# Altium schematic sheet Image.SchDoc
size C; SheetNumber: 1; SheetTotal: 1
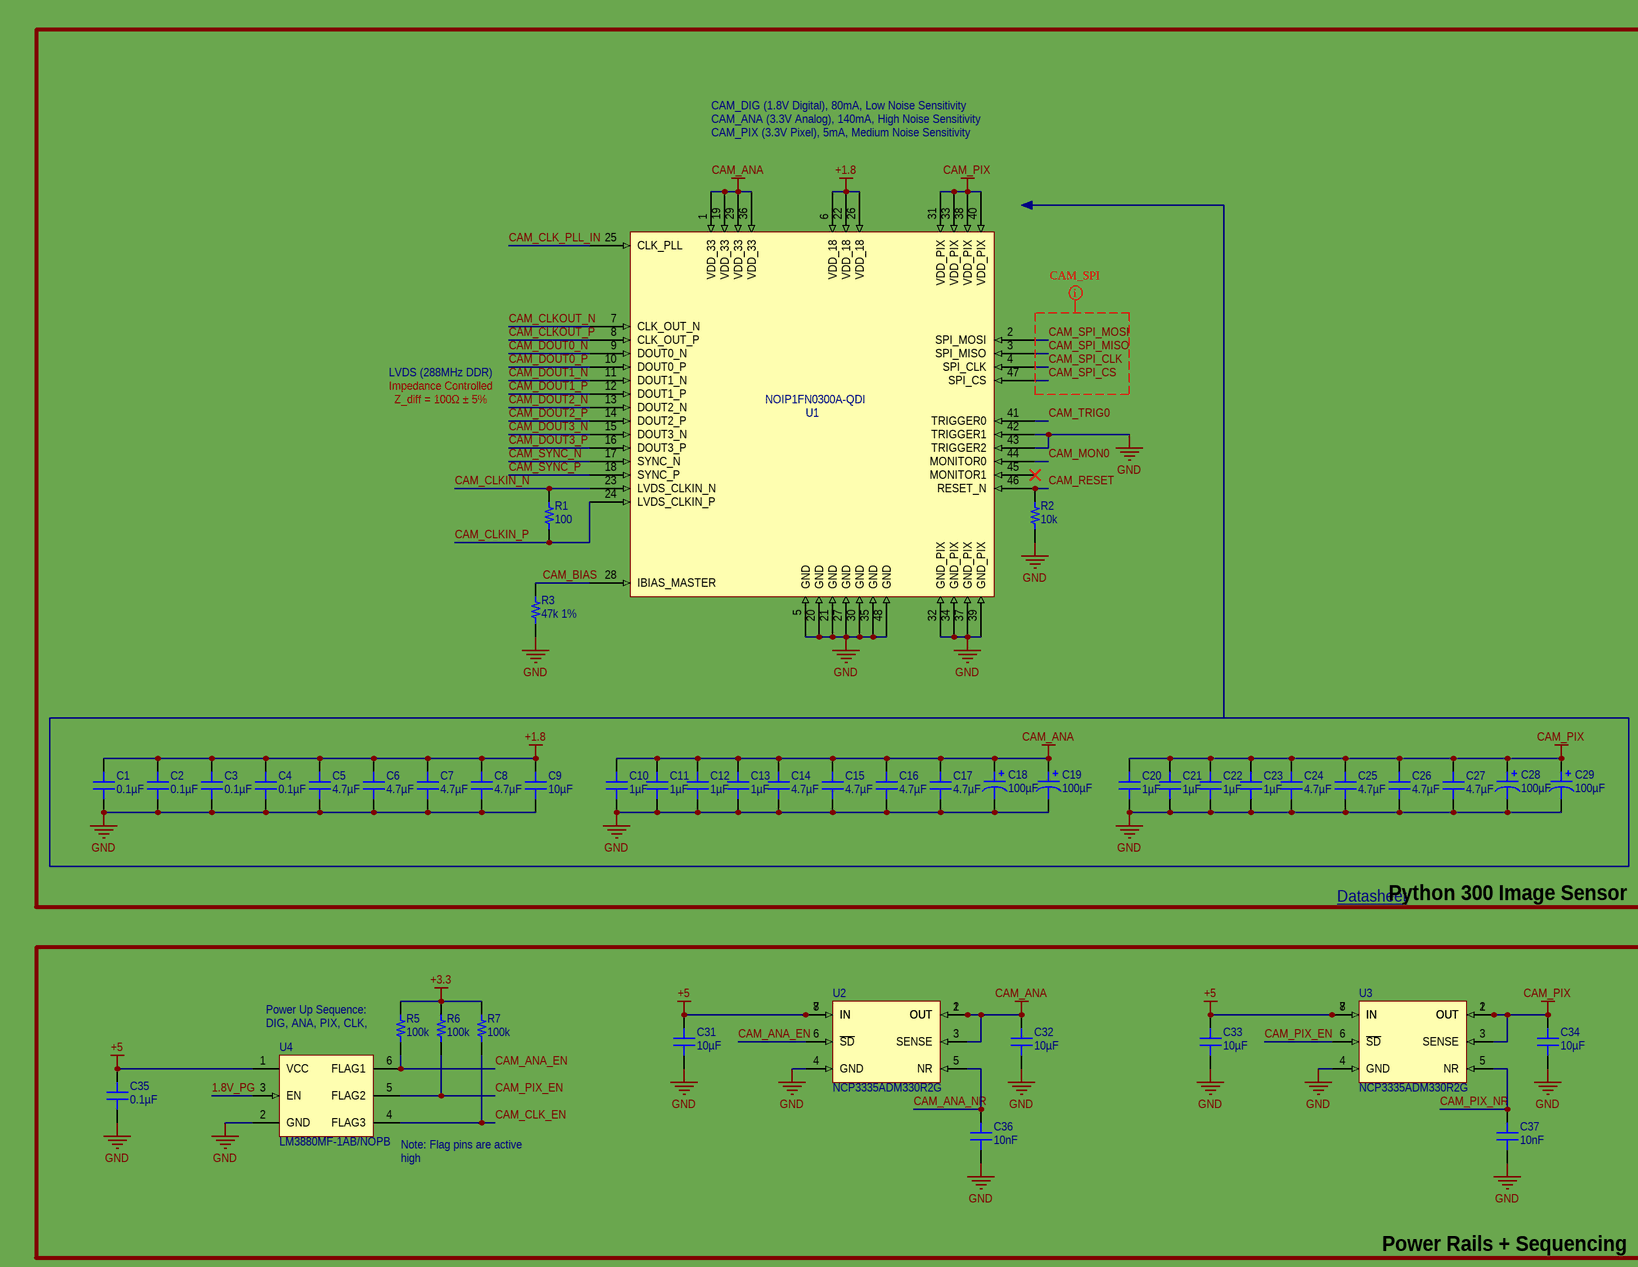
[diagram p0: Image.SchDoc, left]
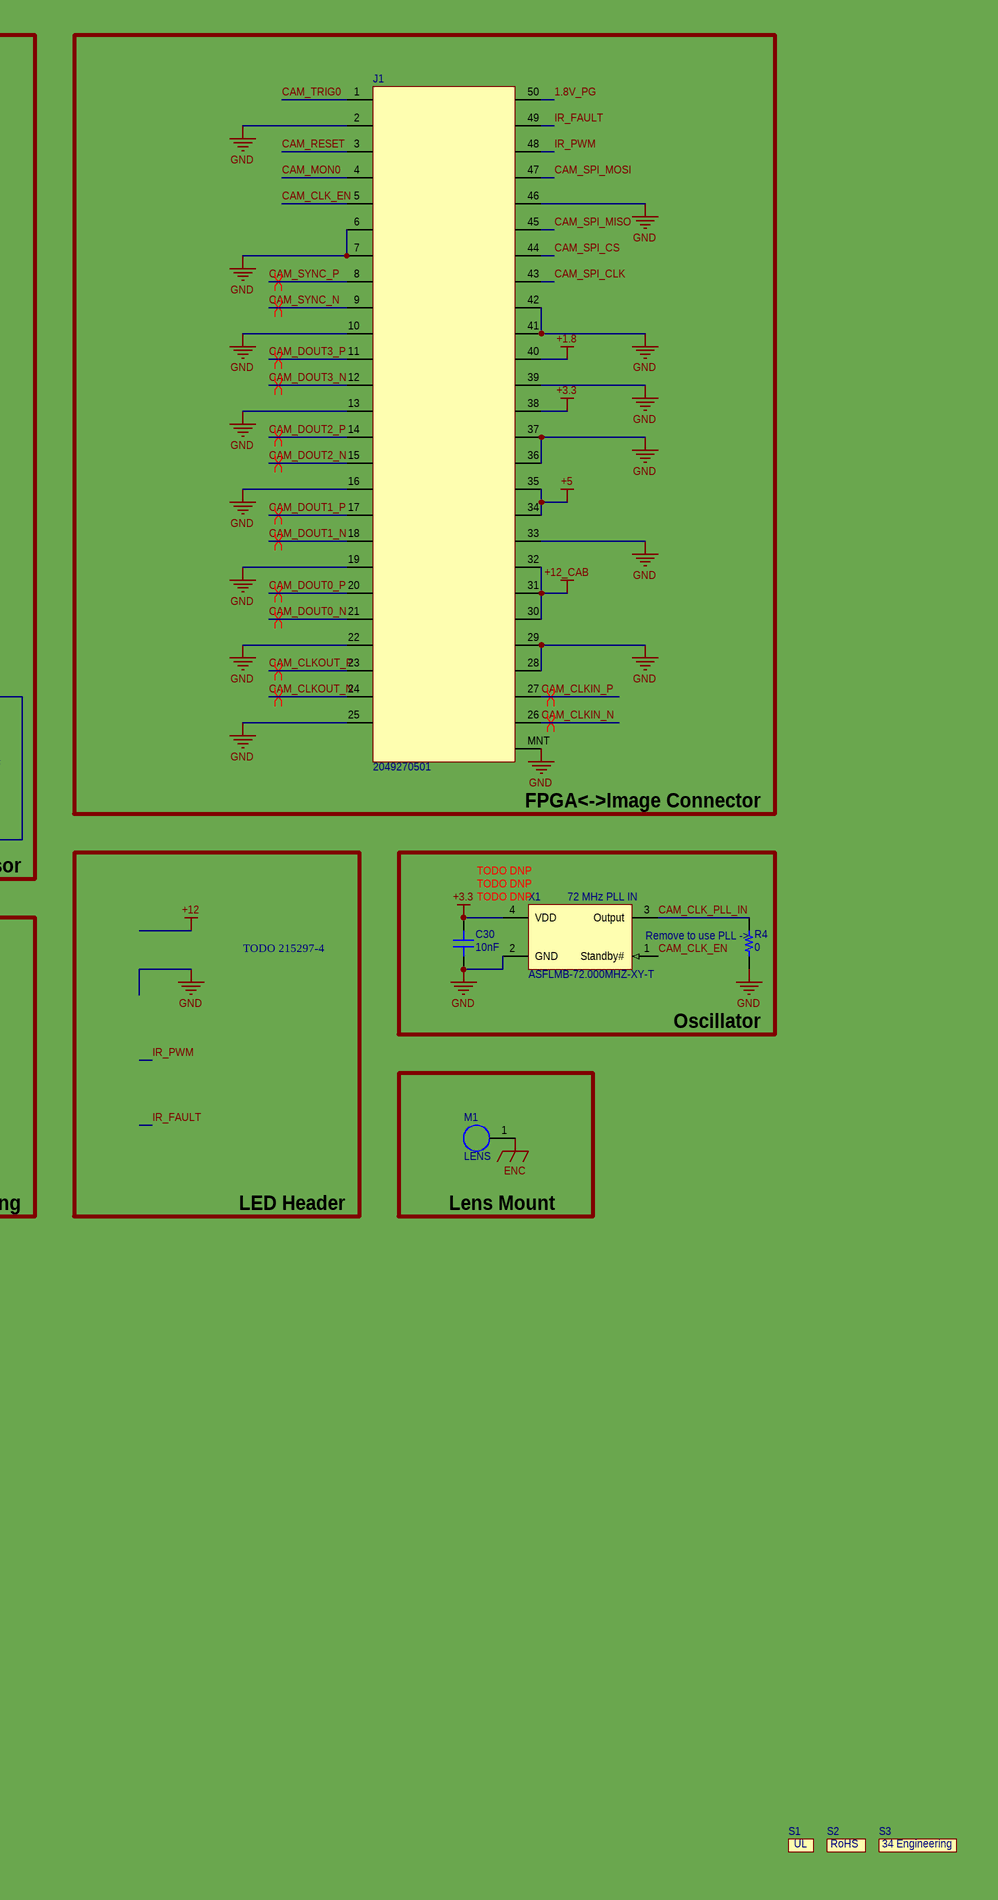
[diagram p1: Image.SchDoc, right]

## Parts
C1  0.1µF  [CAP 0402_1005]
C2  0.1µF  [CAP 0402_1005]
C3  0.1µF  [CAP 0402_1005]
C4  0.1µF  [CAP 0402_1005]
C5  4.7µF  [CAP 0402_1005]
C6  4.7µF  [CAP 0402_1005]
C7  4.7µF  [CAP 0402_1005]
C8  4.7µF  [CAP 0402_1005]
C9  10µF  [CAP 0603_1608]
C10  1µF  [CAP 0402_1005]
C11  1µF  [CAP 0402_1005]
C12  1µF  [CAP 0402_1005]
C13  1µF  [CAP 0402_1005]
C14  4.7µF  [CAP 0402_1005]
C15  4.7µF  [CAP 0402_1005]
C16  4.7µF  [CAP 0402_1005]
C17  4.7µF  [CAP 0402_1005]
C18  100µF  [CAP POL 1411_3528]
C19  100µF  [CAP POL 1411_3528]
C20  1µF  [CAP 0402_1005]
C21  1µF  [CAP 0402_1005]
C22  1µF  [CAP 0402_1005]
C23  1µF  [CAP 0402_1005]
C24  4.7µF  [CAP 0402_1005]
C25  4.7µF  [CAP 0402_1005]
C26  4.7µF  [CAP 0402_1005]
C27  4.7µF  [CAP 0402_1005]
C28  100µF  [CAP POL 1411_3528]
C29  100µF  [CAP POL 1411_3528]
C30  10nF  [CAP 0402_1005]
C31  10µF  [CAP 0402_1005]
C32  10µF  [CAP 0402_1005]
C33  10µF  [CAP 0402_1005]
C34  10µF  [CAP 0402_1005]
C35  0.1µF  [CAP 0402_1005]
C36  10nF  [CAP 0402_1005]
C37  10nF  [CAP 0402_1005]
J1  2049270501  [2049270501]
M1  LENS  [LENS_MNT]
R1  100  [RES 0402_1005]
R2  10k  [RES 0402_1005]
R3  47k 1%  [RES 0402_1005]
R4  0  [RES 0603_1608]
R5  100k  [RES 0402_1005]
R6  100k  [RES 0402_1005]
R7  100k  [RES 0402_1005]
S1  (no value)  [UL]
S2  (no value)  [RoHS]
S3  (no value)  [34EngineeringLogo]
U1  NOIP1FN0300A-QDI  [NOIP1FN0300A-QDI]
U2  NCP3335ADM330R2G  [NCP3335ADM330R2G]
U3  NCP3335ADM330R2G  [NCP3335ADM330R2G]
U4  LM3880MF-1AB/NOPB  [DBV0006A_M]
X1  ASFLMB-72.000MHZ-XY-T  [ASFLMB-72.000MHZ-XY-T]

## Blocks framed on the sheet
Python 300 Image Sensor: C1-C29 R1-R3 U1
FPGA<->Image Connector: J1
Oscillator: C30 R4 X1
Power Rails + Sequencing: C31-C37 R5-R7 U2-U4
Lens Mount: M1

## Nets
+1.8: C1.2 C2.2 C3.2 C4.2 C5.2 C6.2 C7.2 C8.2 C9.2 J1.40 U1.6(VDD_18) U1.22(VDD_18) U1.26(VDD_18)
+3.3: C30.2 J1.38 R5.2 R6.2 R7.2 X1.4(VDD)
+5: C31.2 C33.2 C35.2 J1.34 J1.35 U2.7(IN) U2.8(IN) U3.7(IN) U3.8(IN) U4.1(VCC)
+12_CAB: J1.30 J1.31 J1.32
CAM_ANA: C10.2 C11.2 C12.2 C13.2 C14.2 C15.2 C16.2 C17.2 C18.1 C19.1 C32.2 U1.1(VDD_33) U1.19(VDD_33) U1.29(VDD_33) U1.36(VDD_33) U2.1(OUT) U2.2(OUT) U2.3(SENSE)
CAM_PIX: C20.2 C21.2 C22.2 C23.2 C24.2 C25.2 C26.2 C27.2 C28.1 C29.1 C34.2 U1.31(VDD_PIX) U1.33(VDD_PIX) U1.38(VDD_PIX) U1.40(VDD_PIX) U3.1(OUT) U3.2(OUT) U3.3(SENSE)
ENC: M1.1
GND: C1.1 C2.1 C3.1 C4.1 C5.1 C6.1 C7.1 C8.1 C9.1 C10.1 C11.1 C12.1 C13.1 C14.1 C15.1 C16.1 C17.1 C18.2 C19.2 C20.1 C21.1 C22.1 C23.1 C24.1 C25.1 C26.1 C27.1 C28.2 C29.2 C30.1 C31.1 C32.1 C33.1 C34.1 C35.1 C36.1 C37.1 J1.2 J1.6 J1.7 J1.10 J1.13 J1.16 J1.19 J1.22 J1.25 J1.28 J1.29 J1.33 J1.36 J1.37 J1.39 J1.41 J1.42 J1.46 J1.MNT R2.1 R3.1 R4.1 U1.5(GND) U1.20(GND) U1.21(GND) U1.27(GND) U1.30(GND) U1.32(GND_PIX) U1.34(GND_PIX) U1.35(GND) U1.37(GND_PIX) U1.39(GND_PIX) U1.42(TRIGGER1) U1.43(TRIGGER2) U1.48(GND) U2.4(GND) U3.4(GND) U4.2(GND) X1.2(GND)
1.8V_PG: J1.50 U4.3(EN)
CAM_ANA_EN: R5.1 U2.6(~{SD}) U4.6(FLAG1)
CAM_ANA_NR: C36.2 U2.5(NR)
CAM_BIAS: R3.2 U1.28(IBIAS_MASTER)
CAM_CLK_EN: J1.5 R7.1 U4.4(FLAG3) X1.1(Standby#)
CAM_CLK_PLL_IN: R4.2 U1.25(CLK_PLL) X1.3(Output)
CAM_CLKIN_N: J1.26 R1.2 U1.23(LVDS_CLKIN_N)
CAM_CLKIN_P: J1.27 R1.1 U1.24(LVDS_CLKIN_P)
CAM_CLKOUT_N: J1.24 U1.7(CLK_OUT_N)
CAM_CLKOUT_P: J1.23 U1.8(CLK_OUT_P)
CAM_DOUT0_N: J1.21 U1.9(DOUT0_N)
CAM_DOUT0_P: J1.20 U1.10(DOUT0_P)
CAM_DOUT1_N: J1.18 U1.11(DOUT1_N)
CAM_DOUT1_P: J1.17 U1.12(DOUT1_P)
CAM_DOUT2_N: J1.15 U1.13(DOUT2_N)
CAM_DOUT2_P: J1.14 U1.14(DOUT2_P)
CAM_DOUT3_N: J1.12 U1.15(DOUT3_N)
CAM_DOUT3_P: J1.11 U1.16(DOUT3_P)
CAM_MON0: J1.4 U1.44(MONITOR0)
CAM_PIX_EN: R6.1 U3.6(~{SD}) U4.5(FLAG2)
CAM_PIX_NR: C37.2 U3.5(NR)
CAM_RESET: J1.3 R2.2 U1.46(RESET_N)
CAM_SPI_CLK: J1.43 U1.4(SPI_CLK)
CAM_SPI_CS: J1.44 U1.47(SPI_CS)
CAM_SPI_MISO: J1.45 U1.3(SPI_MISO)
CAM_SPI_MOSI: J1.47 U1.2(SPI_MOSI)
CAM_SYNC_N: J1.9 U1.17(SYNC_N)
CAM_SYNC_P: J1.8 U1.18(SYNC_P)
CAM_TRIG0: J1.1 U1.41(TRIGGER0)
IR_FAULT: J1.49
IR_PWM: J1.48

Not connected (* = marked no-connect by the designer): U1 45(MONITOR1)*

## Layout directives
mark named CAM_SPI: CAM_SPI_CLK, CAM_SPI_CS, CAM_SPI_MISO, CAM_SPI_MOSI
differential pair; differential pair class CAM_DOUT1; rule Signal Stimulus [Kind - Single Pulse    Level - High    Start Time = 0.000    Stop Time = 1.389n    Period Time = 2.778n]: CAM_DOUT1_N, CAM_DOUT1_P
differential pair; differential pair class CAM_DOUT2; rule Signal Stimulus [Kind - Single Pulse    Level - High    Start Time = 0.000    Stop Time = 1.389n    Period Time = 2.778n]: CAM_DOUT2_N, CAM_DOUT2_P
differential pair; differential pair class CAM_DOUT3; rule Signal Stimulus [Kind - Single Pulse    Level - High    Start Time = 0.000    Stop Time = 1.389n    Period Time = 2.778n]: CAM_DOUT3_N, CAM_DOUT3_P
differential pair; differential pair class CAM_SYNC; rule Signal Stimulus [Kind - Single Pulse    Level - High    Start Time = 0.000    Stop Time = 1.389n    Period Time = 2.778n]: CAM_SYNC_N, CAM_SYNC_P
differential pair; differential pair class CAM_CLKOUT; rule Signal Stimulus [Kind - Single Pulse    Level - High    Start Time = 0.000    Stop Time = 1.389n    Period Time = 2.778n]: CAM_CLKOUT_N, CAM_CLKOUT_P
differential pair; differential pair class CAM_DOUT0; rule Signal Stimulus [Kind - Single Pulse    Level - High    Start Time = 0.000    Stop Time = 1.389n    Period Time = 2.778n]: CAM_DOUT0_N, CAM_DOUT0_P
differential pair; differential pair class CAM_CLKIN; rule Signal Stimulus [Kind - Single Pulse    Level - High    Start Time = 0.000    Stop Time = 1.389n    Period Time = 2.778n]: CAM_CLKIN_N, CAM_CLKIN_P

## Notes on the sheet
- CAM_DIG (1.8V Digital), 80mA, Low Noise Sensitivity
  CAM_ANA (3.3V Analog), 140mA, High Noise Sensitivity
  CAM_PIX (3.3V Pixel), 5mA, Medium Noise Sensitivity
- LVDS (288MHz DDR)
- Impedance Controlled
- Z_diff = 100Ω ± 5%
- Datasheet <https://www.onsemi.com/pdf/datasheet/noip1sn1300a-d.pdf>
- TODO DNP
- TODO 215297-4
- (near X1) TODO DNP
- (near X1) 72 MHz PLL IN
- (near R4) Remove to use PLL ->
- (near R5) Power Up Sequence:
  DIG, ANA, PIX, CLK, RESET
- (near U4) Note: Flag pins are active high
- LED Header
- (in symbol 34EngineeringLogo) 34 Engineering

## Library data of the parts
C1-C4 C35 = 0402ZC104KAT2A: CAP CER 0.1UF 10V X7R 0402; manufacturer: AVX Corporation; Tolerance: ±10%; Part Number: 0402ZC104KAT2A; Value: 0.1µF; Applications: General Purpose; Capacitance: 0.1µF; componentlink1description: Datasheet; componentlink1url: http://datasheets.avx.com/X7RDielectric.pdf; componentlink2description: DigiKey Link; componentlink2url: http://digikey.com/product-detail/en/avx-corporation/0402ZC104KAT2A/478-7891-1-ND/3881514; Device Package: 0402 (1005 Metric); lastupdated: 2/8/2022 12:26:59 PM; Lifecycle Status: Active; Minimum Order: 1; Mounting Type: Surface Mount, MLCC; Operating Temperature: -55°C ~ 125°C; Package / Case: 0402 (1005 Metric); packaging: TapeAndReel; partid: 1757; Part Status: Active; price: 0.09; series: -; Size / Dimension: 0.039" L x 0.020" W (1.00mm x 0.50mm); Supplier 1: DigiKey; Supplier Part Number 1: 478-7891-1-ND; Temperature Coefficient: X7R; Thickness (Max): 0.022" (0.55mm); Voltage - Rated: 10V
C5-C8 C14-C17 C24-C27 = 04026D475MAT2A: CAP CER 4.7UF 6.3V X5R 0402; manufacturer: AVX Corporation; Tolerance: ±20%; Part Number: 04026D475MAT2A; Value: 4.7µF; Applications: General Purpose; Capacitance: 4.7µF; componentlink1description: Datasheet; componentlink1url: http://datasheets.avx.com/cx5r.pdf; componentlink2description: DigiKey Link; componentlink2url: http://digikey.com/product-detail/en/avx-corporation/04026D475MAT2A/478-10071-1-ND/6564293; Device Package: 0402 (1005 Metric); lastupdated: 2/8/2022 12:26:39 PM; Lifecycle Status: Active; Minimum Order: 1; Mounting Type: Surface Mount, MLCC; Operating Temperature: -55°C ~ 85°C; Package / Case: 0402 (1005 Metric); packaging: TapeAndReel; partid: 12333; Part Status: Active; price: 0.04; series: -; Size / Dimension: 0.039" L x 0.020" W (1.00mm x 0.50mm); Supplier 1: DigiKey; Supplier Part Number 1: 478-10071-1-ND; Temperature Coefficient: X5R; Thickness (Max): 0.028" (0.71mm); Voltage - Rated: 6.3V
C9 = CL10A106MQ8NNNC: CAP CER 10UF 6.3V X5R 0603; manufacturer: Samsung Electro-Mechanics; Tolerance: ±20%; Part Number: CL10A106MQ8NNNC; Applications: General Purpose; Capacitance: 10 µF; componentlink1description: Datasheet; componentlink1url: http://www.samsungsem.com/kr/support/product-search/mlcc/CL10A106MQ8NNNC.jsp; componentlink2description: DigiKey Link; componentlink2url: https://www.digikey.com/en/products/detail/samsung-electro-mechanics/CL10A106MQ8NNNC/3886777; Device Package: 0603 (1608 Metric); lastupdated: 7/15/2022 11:29:21 AM; Lifecycle Status: Active; Minimum Order: 1; Mounting Type: Surface Mount, MLCC; Operating Temperature: -55°C ~ 85°C; Package / Case: 0603 (1608 Metric); packaging: TapeAndReel; partid: 39822; Part Status: Active; price: 0.01; series: CL; Size / Dimension: 0.063" L x 0.031" W (1.60mm x 0.80mm); Supplier 1: DigiKey; Supplier Part Number 1: 1276-1119-1-ND; Temperature Coefficient: X5R; Thickness (Max): 0.035" (0.90mm); Voltage - Rated: 6.3V
C10-C13 C20-C23 = C0402C105K9PAC7800: CAP CER 1UF 6.3V X5R 0402; manufacturer: KEMET; Tolerance: ±10%; Part Number: C0402C105K9PAC7800; Applications: Bypass, Decoupling; Capacitance: 1 µF; componentlink1description: Datasheet; componentlink1url: https://api.kemet.com/component-edge/download/datasheet/C0402C105K9PACTU.pdf; componentlink2description: DigiKey Link; componentlink2url: https://www.digikey.com/en/products/detail/kemet/C0402C105K9PAC7800/1090778; Device Package: 0402 (1005 Metric); lastupdated: 7/15/2022 11:25:08 AM; Lifecycle Status: Active; Minimum Order: 1; Mounting Type: Surface Mount, MLCC; Operating Temperature: -55°C ~ 85°C; Package / Case: 0402 (1005 Metric); packaging: CutTape; partid: 33394; Part Status: Active; price: 0.01; series: SMD Comm X5R; Size / Dimension: 0.039" L x 0.020" W (1.00mm x 0.50mm); Supplier 1: DigiKey; Supplier Part Number 1: 399-C0402C105K9PAC7800CT-ND; Temperature Coefficient: X5R; Thickness (Max): 0.022" (0.55mm); Voltage - Rated: 6.3V
C18 C19 C28 C29 = TPSB107M010R0400: CAP TANT 100UF 20% 10V 1411; manufacturer: AVX Corporation; Manufacturer Size Code: B; ESR (Equivalent Series Resistance): 400mOhm; Type: Molded; Part Number: TPSB107M010R0400; Value: 100µF; Capacitance: 100µF; componentlink1description: Datasheet; componentlink1url: http://datasheets.avx.com/TPS.pdf; componentlink2description: DigiKey Link; componentlink2url: http://digikey.com/product-detail/en/avx-corporation/TPSB107M010R0400/478-5231-1-ND/1913301; Features: General Purpose; Height - Seated (Max): 0.083" (2.10mm); lastupdated: 9/2/2020 1:15:46 AM; Lifecycle Status: Active; Minimum Order: 1; Mounting Type: Surface Mount; Operating Temperature: -55°C ~ 125°C; Package / Case: 1411 (3528 Metric), 1210; packaging: TapeAndReel; partid: 84; Part Status: Active; price: 0.31; series: TPS; Size / Dimension: 0.138" L x 0.110" W (3.50mm x 2.80mm); Supplier 1: DigiKey; Supplier Part Number 1: 478-5231-1-ND; Tolerance: ±20%; Voltage - Rated: 10V
C30 C36 C37 = 0402B103K6R3CT: CAP CER 10000PF 6.3V X7R 0402; manufacturer: Walsin Technology Corporation; Tolerance: ±10%; Part Number: 0402B103K6R3CT; Value: 10000 pF; Applications: General Purpose; Capacitance: 10000 pF; componentlink1description: Datasheet; componentlink1url: http://www.passivecomponent.com/wp-content/uploads/2018/10/MLCC.pdf; componentlink2description: DigiKey Link; componentlink2url: https://www.digikey.com/en/products/detail/walsin-technology-corporation/0402B103K6R3CT/9354671; Device Package: 0402 (1005 Metric); lastupdated: 7/10/2022 8:59:10 AM; Lifecycle Status: Active; Minimum Order: 1; Mounting Type: Surface Mount, MLCC; Operating Temperature: -55°C ~ 125°C; Package / Case: 0402 (1005 Metric); packaging: CutTape; partid: 11629; Part Status: Active; price: 0.01; series: -; Size / Dimension: 0.039" L x 0.020" W (1.00mm x 0.50mm); Supplier 1: DigiKey; Supplier Part Number 1: 1292-1173-1-ND; Temperature Coefficient: X7R; Thickness (Max): 0.022" (0.55mm); Voltage - Rated: 6.3V
C31-C34 = 0402ZD106MAT2A: CAP CER 10UF 10V X5R 0402; manufacturer: AVX Corporation; Tolerance: ±20%; Part Number: 0402ZD106MAT2A; Value: 10µF; Applications: General Purpose; Capacitance: 10µF; componentlink1description: Datasheet; componentlink1url: http://datasheets.avx.com/cx5r.pdf; componentlink2description: DigiKey Link; componentlink2url: http://digikey.com/product-detail/en/avx-corporation/0402ZD106MAT2A/478-10052-1-ND/6564275; Device Package: 0402 (1005 Metric); lastupdated: 2/8/2022 12:26:50 PM; Lifecycle Status: Active; Minimum Order: 1; Mounting Type: Surface Mount, MLCC; Operating Temperature: -55°C ~ 85°C; Package / Case: 0402 (1005 Metric); packaging: TapeAndReel; partid: 6854; Part Status: Active; price: 0.24; series: -; Size / Dimension: 0.039" L x 0.020" W (1.00mm x 0.50mm); Supplier 1: DigiKey; Supplier Part Number 1: 478-10052-1-ND; Temperature Coefficient: X5R; Thickness (Max): 0.028" (0.71mm); Voltage - Rated: 10V
J1 = 2049270501: SlimStack Board-to-Board Receptacle, 0.40mm Pitch, FSB3 Floating Series, 3.00mm Mated Height, 3.20mm Mated Width, 50...; Manufacturer: Molex; Manufacturer Part Number: 203955-0503; RoHS: No; Stock 1: 8587; Pricing 1: 1=3.72000, 10=3.28000, 50=3.28000, 100=2.61000, 1000=2.16000, 10000=2.01000 (USD); Supplier 1: Mouser; Supplier Part Number 1: 538-204927-0501
M1 = LENS_MNT: Virtex Python 300 Lens Mount 34V0-LN-MNT
R1 = CRG0402F100R: RES SMD 100 OHM 1% 1/16W 0402; Manufacturer: TE Connectivity Passive Product; Power (Watts): 0.063W, 1/16W; Resistance: 100 Ohms; Temperature Coefficient: ±100ppm/°C; Part Number: CRG0402F100R; ComponentLink1Description: Datasheet; ComponentLink1URL: https://www.te.com/commerce/DocumentDelivery/DDEController?Action=srchrtrv&DocNm=1773204&DocType=DS&DocLang=English; ComponentLink2Description: DigiKey Link; ComponentLink2URL: https://www.digikey.com/en/products/detail/te-connectivity-passive-product/CRG0402F100R/2390484; Composition: Thick Film; Device Package: 0402 (1005 Metric); Height - Seated (Max): 0.016" (0.40mm); LastUpdated: 7/15/2022 11:42:13 AM; Lifecycle Status: Active; Minimum Order: 1; Number of Terminations: 2; Operating Temperature: -55°C ~ 155°C; Package / Case: 0402 (1005 Metric); Packaging: CutTape; PartId: 20718; Part Status: Active; Price: 0.01; Series: CRG, Neohm; Size / Dimension: 0.039" L x 0.020" W (1.00mm x 0.50mm); Supplier 1: DigiKey; Supplier Part Number 1: A121527CT-ND; Supplier Device Package: 0402; Tolerance: ±1%
R2 = MCS0402MC1002FE000: RES SMD 10K OHM 1% 1/10W 0402; Manufacturer: Vishay Beyschlag; Value: 10 kOhms; Power (Watts): 0.1W, 1/10W; Temperature Coefficient: ±50ppm/°C; Part Number: MCS0402MC1002FE000; ComponentLink1Description: Datasheet; ComponentLink1URL: http://www.vishay.com/docs/28760/mcat_pro.pdf; ComponentLink2Description: DigiKey Link; ComponentLink2URL: http://digikey.com/product-detail/en/vishay-beyschlag/MCS0402MC1002FE000/MCS0402-10.0K-MFCT-ND/3883092; Composition: Thin Film; Device Package: 0402 (1005 Metric); Features: Anti-Sulfur, Automotive AEC-Q200; Height - Seated (Max): 0.015" (0.37mm); LastUpdated: 7/10/2022 9:15:04 AM; Lifecycle Status: Active; Minimum Order: 1; Number of Terminations: 2; Operating Temperature: -55°C ~ 175°C; Package / Case: 0402 (1005 Metric); Packaging: TapeAndReel; PartId: 3152; Part Status: Active; Price: 0.03; Ratings: AEC-Q200; Resistance: 10 kOhms; Series: MCS AT - Professional; Size / Dimension: 0.039" L x 0.020" W (1.00mm x 0.50mm); Supplier 1: DigiKey; Supplier Part Number 1: MCS0402-10.0K-MFCT-ND; Supplier Device Package: 0402; Tolerance: ±1%
R3 = RMCF0402FT47K0: RES 47K OHM 1% 1/16W 0402; Manufacturer: Stackpole Electronics Inc; Value: 47 kOhms; Power (Watts): 0.063W, 1/16W; Temperature Coefficient: ±100ppm/°C; Part Number: RMCF0402FT47K0; ComponentLink1Description: Datasheet; ComponentLink1URL: https://www.seielect.com/catalog/sei-rmcf_rmcp.pdf; ComponentLink2Description: DigiKey Link; ComponentLink2URL: https://www.digikey.com/en/products/detail/stackpole-electronics-inc/RMCF0402FT47K0/1714749; Composition: Thick Film; Device Package: 0402 (1005 Metric); Features: Automotive AEC-Q200; Height - Seated (Max): 0.016" (0.40mm); LastUpdated: 7/10/2022 9:14:59 AM; Lifecycle Status: Active; Minimum Order: 1; Number of Terminations: 2; Operating Temperature: -55°C ~ 155°C; Package / Case: 0402 (1005 Metric); Packaging: CutTape; PartId: 4957; Part Status: Active; Price: 0.01; Ratings: AEC-Q200; Resistance: 47 kOhms; Series: RMCF; Size / Dimension: 0.039" L x 0.020" W (1.00mm x 0.50mm); Supplier 1: DigiKey; Supplier Part Number 1: RMCF0402FT47K0CT-ND; Supplier Device Package: 0402; Tolerance: ±1%
R4 = CRCW06030000Z0EAHP: RES SMD 0 OHM JUMPER 1/3W 0603; Manufacturer: Vishay Dale; Power (Watts): 0.333W, 1/3W; Resistance: 0 Ohms; Part Number: CRCW06030000Z0EAHP; ComponentLink1Description: Datasheet; ComponentLink1URL: http://www.vishay.com/docs/20043/crcwhpe3.pdf; ComponentLink2Description: DigiKey Link; ComponentLink2URL: https://www.digikey.com/en/products/detail/vishay-dale/CRCW06030000Z0EAHP/2222231; Composition: Thick Film; Device Package: 0603 (1608 Metric); Features: Automotive AEC-Q200, Pulse Withstanding; Height - Seated (Max): 0.022" (0.55mm); LastUpdated: 7/15/2022 11:50:24 AM; Lifecycle Status: Active; Minimum Order: 1; Number of Terminations: 2; Operating Temperature: -55°C ~ 155°C; Package / Case: 0603 (1608 Metric); Packaging: TapeAndReel; PartId: 5474; Part Status: Active; Price: 0.01; Ratings: AEC-Q200; Series: CRCW-HP; Size / Dimension: 0.063" L x 0.033" W (1.60mm x 0.85mm); Supplier 1: DigiKey; Supplier Part Number 1: 541-0.0SBCT-ND; Supplier Device Package: 0603; Tolerance: Jumper
R5-R7 = MCS04020C1003FE000: RES SMD 100K OHM 1% 1/10W 0402; Manufacturer: Vishay Beyschlag; Value: 100 kOhms; Power (Watts): 0.1W, 1/10W; Temperature Coefficient: ±50ppm/°C; Part Number: MCS04020C1003FE000; ComponentLink1Description: Datasheet; ComponentLink1URL: http://www.vishay.com/docs/28705/mcx0x0xpro.pdf; ComponentLink2Description: DigiKey Link; ComponentLink2URL: http://digikey.com/product-detail/en/vishay-beyschlag/MCS04020C1003FE000/MCS0402-100K-CFCT-ND/2607930; Composition: Thin Film; Device Package: 0402 (1005 Metric); Features: Anti-Sulfur; Height - Seated (Max): 0.015" (0.37mm); LastUpdated: 7/10/2022 9:15:04 AM; Lifecycle Status: Active; Minimum Order: 1; Number of Terminations: 2; Operating Temperature: -55°C ~ 155°C; Package / Case: 0402 (1005 Metric); Packaging: TapeAndReel; PartId: 3149; Part Status: Active; Price: 0.03; Resistance: 100 kOhms; Series: MCS - Professional; Size / Dimension: 0.039" L x 0.020" W (1.00mm x 0.50mm); Supplier 1: DigiKey; Supplier Part Number 1: MCS0402-100K-CFCT-ND; Supplier Device Package: 0402; Tolerance: ±1%
S1 = UL
S2 = RoHS
S3 = 34EngineeringLogo: 34 Engineering Silkscreen Logo
U1 = NOIP1FN0300A-QDI: IC IMAGE SENSOR 0.3MP 48LCC; Manufacturer: ON Semiconductor; Operating Supply Voltage: 3.4V; Supplier 1: Avnet; Manufacturer Part Number: NOIP1FN0300A-QDI; RoHS: Yes; Category: Optoelectronics; Pricing 1: 6=58.23675, 8=57.37875, 20=56.62800, 30=55.87725, 60=55.12650, 300=53.83950, 600=53.41050 (USD); Mount: Surface Mount; Case/Package: LCC; Number of Pins: 48; Min Operating Temperature: -40°C; Max Operating Temperature: 85°C; Lead Free: Lead Free; RoHS Compliant: Yes; ComponentLink1URL: http://www.onsemi.com/pub_link/Collateral/PB_NOIP1SN1300A-D.PDF?src-supplier=Digi-Key; ComponentLink1Description: http://www.onsemi.com/pub_link/Collateral/PB_NOIP1SN1300A-D.PDF?src-supplier=Digi-Key; ComponentLink2URL: http://www.onsemi.com/pub_link/Collateral/NOIP1SN1300A-D.PDF?src-supplier=Avnet+Asia; ComponentLink2Description: http://www.onsemi.com/pub_link/Collateral/NOIP1SN1300A-D.PDF?src-supplier=Avnet+Asia; Supplier Part Number 1: NOIP1FN0300A-QDI
U2 U3 = NCP3335ADM330R2G: Linear Voltage Regulator, LDO, Ultra High Accuracy, Low Iq, 500 mA, V out : 3.3 V; Manufacturer: ON Semiconductor; Min Input Voltage: 2.6V; Max Input Voltage: 16V; Output Voltage: 3.3V; Number of Outputs: 1; Max Output Current: 800mA; Polarity: Positive; Accuracy: 0.9%; Output Type: Fixed; Dropout Voltage: 340mV; Reference Voltage: 1.269V; Supplier 1: Arrow Electronics; Manufacturer Part Number: NCP3335ADM330R2G; RoHS: Yes; Category: Voltage Regulators - Linear; Stock 1: 3509; Pricing 1: 1=1.27050, 10=1.10060, 25=0.93500, 100=0.82150, 250=0.81330, 500=0.66300, 1000=0.61180, 3000=0.57730 (USD); Mount: Surface Mount; Case/Package: MSOP; Number of Pins: 8; Min Operating Temperature: -40°C; Max Operating Temperature: 150°C; Package Quantity: 4000; Output Current: 800mA; Packaging: Tape and Reel; Number of Regulators: 1; Min Output Voltage: 3.3V; Output Voltage Accuracy: 0.9%; Length: 3.1mm; Width: 3.1mm; Height: 0.95mm; Radiation Hardening: No; Lead Free: Lead Free; Halogen Free: Halogen Free; RoHS Compliant: Yes; ComponentLink1URL: https://datasheet.ciiva.com/30476/0900766b8124f876-30476966.pdf?src-supplier=RSComponents; ComponentLink1Description: https://datasheet.ciiva.com/30476/0900766b8124f876-30476966.pdf?src-supplier=RSComponents; ComponentLink2URL: https://datasheet.ciiva.com/2061/ncp3335a-d-2061837.pdf?src-supplier=Digi-Key; ComponentLink2Description: https://datasheet.ciiva.com/2061/ncp3335a-d-2061837.pdf?src-supplier=Digi-Key; ComponentLink3URL: https://datasheet.ciiva.com/2061/ncp3335a-d-2061838.pdf?src-supplier=Digi-Key; ComponentLink3Description: https://datasheet.ciiva.com/2061/ncp3335a-d-2061838.pdf?src-supplier=Digi-Key; ComponentLink4URL: https://datasheet.ciiva.com/16390/ncp3335a-d-16390281.pdf?src-supplier=Future+Electronics; ComponentLink4Description: https://datasheet.ciiva.com/16390/ncp3335a-d-16390281.pdf?src-supplier=Future+Electronics; Supplier Part Number 1: NCP3335ADM330R2G
U4 = CMP-0063-01011-4: Power Sequencer, 6-pin SOT-23, Pb-Free, 1000 Reel; Manufacturer: Texas Instruments; High-Reliability: Y; CompType: MiscPower; PowerWise: N; PackageTopMarking: F21A*XTT; Code_JEDEC: MO-178-AB; PartNumber: LM3880MF-1AB/NOPB; RoHS: Y; PackageReference: DBV0006A; ComponentLink1Description: Datasheet URL; Code_IPC: SOT26A-6; PinCount: 6; PackageDescription: Molded SOT-23, .115 x .063 x .040in Body, 6 Lead, .0375in in Pitch; ComponentLink1URL: http://www.ti.com/general/docs/lit/getliterature.tsp?genericPartNumber=LM3880&fileType=pdf
X1 = ASFLMB-72.000MHZ-XY-T: Silicon Oscillator 72MHz 15pF ±10ppm 4-Pin QFN T/R; Manufacturer: Abracon; Operating Supply Voltage: 3.6V; Max Supply Current: 16mA; Supplier 1: Mouser; Manufacturer Part Number: ASFLMB-72.000MHZ-XY-T; RoHS: Yes; Category: Oscillators; Stock 1: 318; Pricing 1: 1=3.61000, 10=3.45000, 50=3.27000, 100=2.93000, 500=2.76000, 1000=2.40000, 10000=2.40000 (USD); Mount: Surface Mount; Case/Package: SMD/SMT; Number of Pins: 4; Min Operating Temperature: -40°C; Max Operating Temperature: 105°C; Frequency: 72MHz; Load Capacitance: 15pF; Packaging: Tape and Reel; Frequency Stability: 10ppm; Termination: SMD/SMT; Series: Pure Silicon™ ASFLMB; Length: 0.197inch; Width: 0.126inch; Height: 0.035inch; Radiation Hardening: No; ComponentLink1URL: https://datasheet.ciiva.com/870/memspeedproflyerii-870042.pdf?src-supplier=Digi-Key; ComponentLink1Description: https://datasheet.ciiva.com/870/memspeedproflyerii-870042.pdf?src-supplier=Digi-Key; ComponentLink2URL: https://datasheet.ciiva.com/870/memspeedproflyerii-870043.pdf?src-supplier=Digi-Key; ComponentLink2Description: https://datasheet.ciiva.com/870/memspeedproflyerii-870043.pdf?src-supplier=Digi-Key; ComponentLink3URL: https://datasheet.ciiva.com/870/memspeedproflyerii-870044.pdf?src-supplier=Digi-Key; ComponentLink3Description: https://datasheet.ciiva.com/870/memspeedproflyerii-870044.pdf?src-supplier=Digi-Key; ComponentLink4URL: https://datasheet.ciiva.com/3178/asflmb-3178058.pdf?src-supplier=Avnet; ComponentLink4Description: https://datasheet.ciiva.com/3178/asflmb-3178058.pdf?src-supplier=Avnet; ComponentLink5URL: https://datasheet.ciiva.com/13163/asflmb-24525-13163049.pdf?src-supplier=Mouser; ComponentLink5Description: https://datasheet.ciiva.com/13163/asflmb-24525-13163049.pdf?src-supplier=Mouser; Supplier Part Number 1: 815-ASFLMB-72-XY-T